# Altium schematic sheet Main.SchDoc
size A
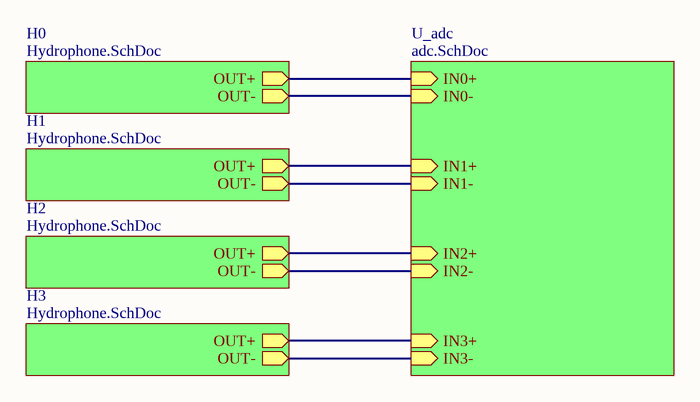
[diagram p0: Main.SchDoc]

## Sub-sheets
H0 = Hydrophone.SchDoc: OUT+ (out), OUT- (out)
H1 = Hydrophone.SchDoc: OUT+ (out), OUT- (out)
H2 = Hydrophone.SchDoc: OUT+ (out), OUT- (out)
H3 = Hydrophone.SchDoc: OUT+ (out), OUT- (out)
U_adc = adc.SchDoc: IN0+ (in), IN0- (in), IN1+ (in), IN1- (in), IN2+ (in), IN2- (in), IN3+ (in), IN3- (in)

## Nets
(unnamed): sheet U_adc/IN0+, sheet H0/OUT+
(unnamed): sheet U_adc/IN0-, sheet H0/OUT-
(unnamed): sheet U_adc/IN1+, sheet H1/OUT+
(unnamed): sheet U_adc/IN1-, sheet H1/OUT-
(unnamed): sheet U_adc/IN2+, sheet H2/OUT+
(unnamed): sheet U_adc/IN2-, sheet H2/OUT-
(unnamed): sheet U_adc/IN3+, sheet H3/OUT+
(unnamed): sheet U_adc/IN3-, sheet H3/OUT-